# EAGLE schematic adapter RX2189 (EAGLE 9.3.1)
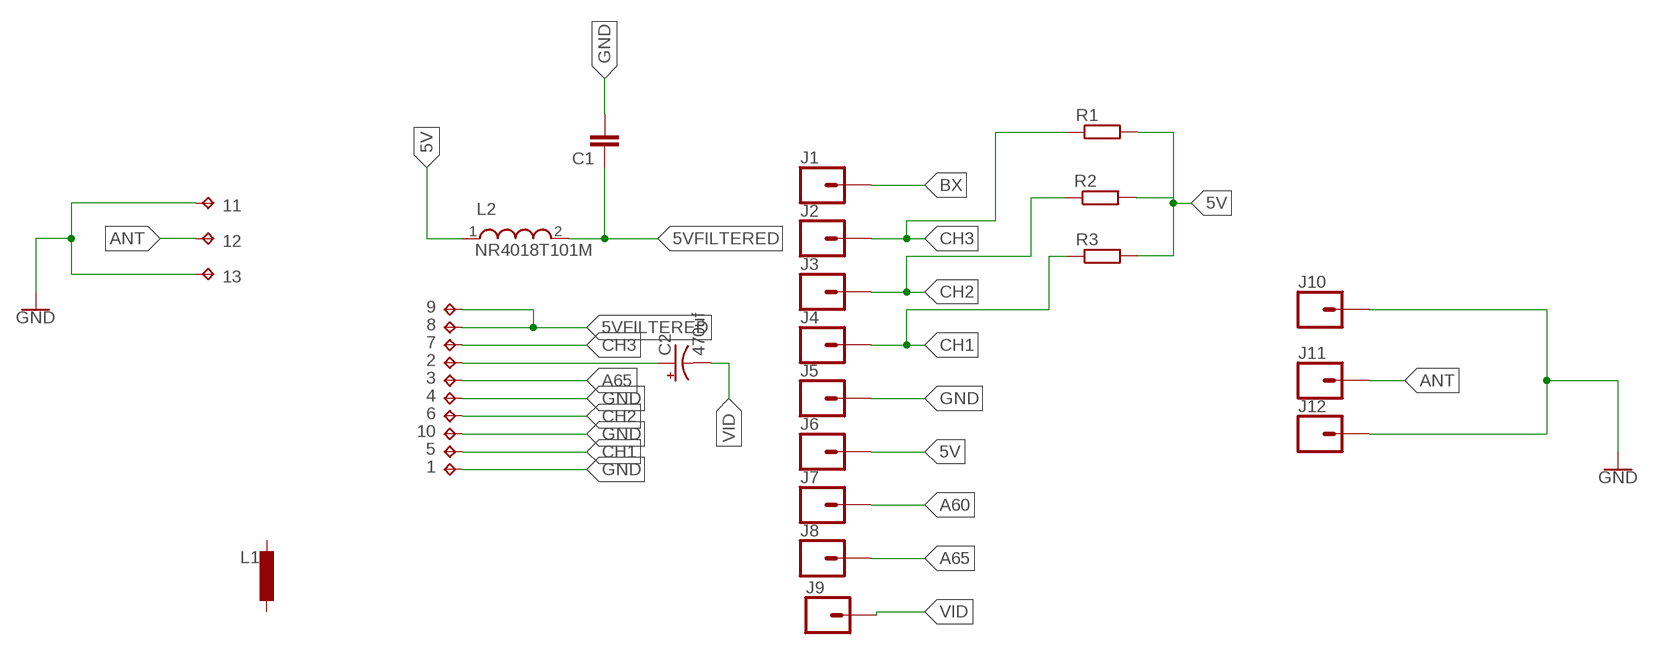
[diagram p0: schematic, sheet 1]

## Parts
1  TPTP10SQ  [TP10SQ]
2  TPTP10SQ  [TP10SQ]
3  TPTP10SQ  [TP10SQ]
4  TPTP10SQ  [TP10SQ]
5  TPTP10SQ  [TP10SQ]
6  TPTP10SQ  [TP10SQ]
7  TPTP10SQ  [TP10SQ]
8  TPTP10SQ  [TP10SQ]
9  TPTP10SQ  [TP10SQ]
10  TPTP10SQ  [TP10SQ]
11  TPTP10SQ  [TP10SQ]
12  TPTP10SQ  [TP10SQ]
13  TPTP10SQ  [TP10SQ]
C1  C-EUC1206K  [C1206K]
C2  470uf  CAP_POL7343  [EIA7343]
J1  CONN_01PTH_NO_SILK_KIT  [1X01NS_KIT]
J2  CONN_01PTH_NO_SILK_KIT  [1X01NS_KIT]
J3  CONN_01PTH_NO_SILK_KIT  [1X01NS_KIT]
J4  CONN_01PTH_NO_SILK_KIT  [1X01NS_KIT]
J5  CONN_01PTH_NO_SILK_KIT  [1X01NS_KIT]
J6  CONN_01PTH_NO_SILK_KIT  [1X01NS_KIT]
J7  CONN_01PTH_NO_SILK_KIT  [1X01NS_KIT]
J8  CONN_01PTH_NO_SILK_KIT  [1X01NS_KIT]
J9  CONN_01PTH_NO_SILK_KIT  [1X01NS_KIT]
J10  CONN_01PTH_NO_SILK_KIT  [1X01NS_KIT]
J11  CONN_01PTH_NO_SILK_KIT  [1X01NS_KIT]
J12  CONN_01PTH_NO_SILK_KIT  [1X01NS_KIT]
L1  L-EUWE-TPC  [POWER-CHOKE_WE-TPC]
L2  NR4018T101M  NRS5020T220MMGJ  [INDM4949X200N]
R1  R-EU_R0603  [R0603]
R2  R-EU_R0603  [R0603]
R3  R-EU_R0603  [R0603]

## Nets
5V [power]: J6.1 L2.1 R1.2 R2.2 R3.2
5VFILTERED: 8.TP 9.TP C1.1 L2.2
A60: J7.1
A65: 3.TP J8.1
ANT [power]: 12.TP J11.1
BX: J1.1
CH1: 5.TP J4.1 R3.1
CH2: 6.TP J3.1 R2.1
CH3: 7.TP J2.1 R1.1
GND [power]: 1.TP 4.TP 10.TP 11.TP 13.TP C1.2 J5.1 J10.1 J12.1
N$1: 2.TP C2.A(+)
VID [power]: C2.C(-) J9.1
Unconnected: L1.1 L1.2

## Library data of the parts
1-13 = testpad:TP: Test pad
C1 = resistor:C-EU: CAPACITOR, European symbol
C2 = SparkFun-Passives:CAP_POL: Capacitor Polarized These are standard SMD and PTH capacitors. Normally 10uF, 47uF, and 100uF in electrolytic and tantalum varieties. Always verify the external diameter of the through hole cap, it varies with capacity, voltage, and manufacturer. The EIA devices should be standard.
J1-J12 = SparkFun-Connectors:CONN_01: Single connection point. Often used as Generic Header-pin footprint for 0.1 inch spaced/style header connections On any of the 0.1 inch spaced packages, you can populate with these: Break Away Headers - Straight <https://www.sparkfun.com/products/116> (PRT-00116) Break Away Male Headers - Right Angle <https://www.sparkfun.com/products/553> (PRT-00553) Female Headers <https://www.sparkfun.com/products/115> (PRT-00115) Break Away Headers - Machine Pin <https://www.sparkfun.com/products/117> (PRT-00117) Break Away Female Headers - Swiss Machine Pin <https://www.sparkfun.com/products/743> (PRT-00743) This device is also useful as a general connection point to wire up your design to another part of your project. Our various solder wires solder well into these plated through hole pads. Hook-Up Wire - Assortment (Stranded, 22 AWG) <https://www.sparkfun.com/products/11375> (PRT-11375) Hook-Up Wire - Assortment (Solid Core, 22 AWG) <https://www.sparkfun.com/products/11367> (PRT-11367) View the entire wire category on our website here <https://www.sparkfun.com/categories/141> Special notes: SMTSO-256-ET is a "flush mount" nut for a 4-40 screw. We mostly use this on specialty testbeds; it is a nice way to connect hardware to your PCB at an adjustable hieght. Also note, the SNAP packages are for using a snappable style connector. We sell a baggie of snaps and they are also used on two LilyPad designs: Snap Assortment - 30 pack (male and female) <https://www.sparkfun.com/products/11347> (DEV-11347) LilyPad Arduino SimpleSnap <https://www.sparkfun.com/products/10941> (DEV-10941) LilyPad SimpleSnap Protoboard <https://www.sparkfun.com/products/10940> (DEV-10940)
L1 = rcl:L-EU: INDUCTOR, European symbol; SPICEPREFIX: L
L2 = NRS5020T220MMGJ:NRS5020T220MMGJ: Inductor Power Shielded Wirewound 22uH 20% 100KHz Ferrite 1A 312mOhm DCR T/R; AVAILABILITY: Unavailable; DESCRIPTION: Inductor Power Shielded Wirewound 22uH 20% 100KHz Ferrite 1A 312mOhm DCR T/R; MF: Taiyo Yuden; MP: NRS5020T220MMGJ; PACKAGE: Nonstandard Taiyo Yuden; PRICE: None
R1-R3 = resistor:R-EU_: RESISTOR, European symbol

## Net classes
0 default: width 0.2 mm, clearance 0.2 mm
1 power: width 0.3 mm, drill 0.3 mm, clearance 0.3 mm